# Altium project oai_kpa_mku.PrjPcb (part 2 of 2)

## Sheet Functional_Module_main.SchDoc: =GlobalProjectName
size 209 x 297 mm; ApprovedBy: Утвердил; CheckedBy: Проверил; Author: Разработал; DocumentNumber: ЮМП.250. Э3; Revision: #2.2; SheetNumber: 8; SheetTotal: 9; PageSetup: Record=PageOptions|CenterHorizontal=True|CenterVertical=True|PrintScale=1.00|XCorrection=1.00|YCorrection=1.00|PrintKind=1|BorderSize=5000000|LeftOffset=0|BottomOffset=0|Orientation=2|PaperLength=1000|PaperWidth=1000|Scale=100|PaperSource=15|PrintQuality=1200|MediaType=1|DitherType=10|PaperKind=A3|PrintScaleMode=1; Weight: -; ScaleFactor: -; NormInspection: Норм.Контр.; FirstApplication: ЮМП.250.; DocumentName: OAI_KPA_MKU
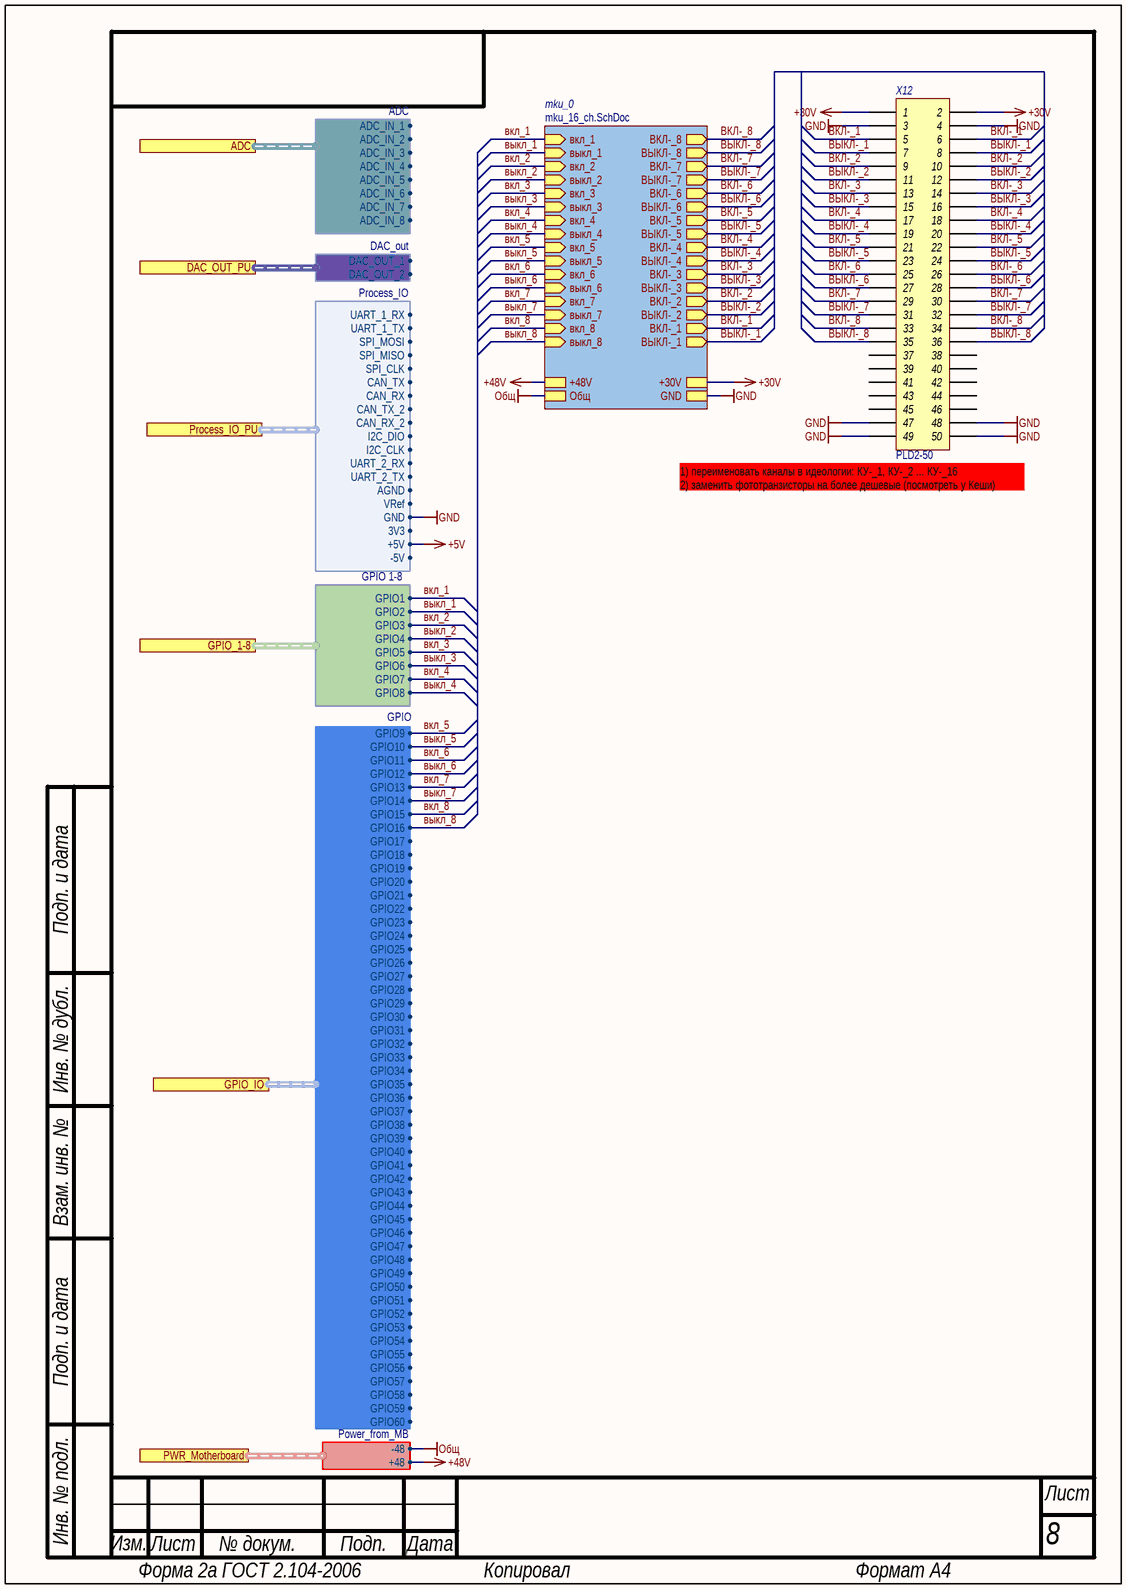
[diagram p7: Functional_Module_main.SchDoc]

### Parts
X12  Header 2X25  [PLD2-50]  (value not drawn)

### Sub-sheets
mku_0 = mku_16_ch.SchDoc: Общ, GND, вкл_2 (in), вкл_4 (in), вкл_3 (in), выкл_1 (in), выкл_5 (in), выкл_8 (in), вкл_7 (in), ВЫКЛ-_1 (out), вкл_1 (in), ВКЛ-_1 (out), выкл_7 (in), выкл_6 (in), выкл_2 (in), вкл_5 (in), вкл_6 (in), выкл_3 (in), вкл_8 (in), выкл_4 (in), ВЫКЛ-_2 (out), ВКЛ-_2 (out), ВЫКЛ-_3 (out), ВКЛ-_3 (out), ВЫКЛ-_4 (out), ВКЛ-_4 (out), ВЫКЛ-_5 (out), ВКЛ-_5 (out), ВЫКЛ-_6 (out), ВКЛ-_6 (out), ВЫКЛ-_7 (out), ВКЛ-_7 (out), ВЫКЛ-_8 (out), ВКЛ-_8 (out), +48V, +30V

### Ports
ADC (harness ADC), DAC_OUT_PU (harness DAC_out), GPIO_1-8 (harness GPIO 1-8), GPIO_IO (harness GPIO), Process_IO_PU (harness Process_IO), PWR_Motherboard (harness Power_from_MB)

### Harnesses
Process_IO: UART_1_RX, UART_1_TX, SPI_MOSI, SPI_MISO, SPI_CLK, CAN_TX, CAN_RX, I2C_DIO, I2C_CLK, UART_2_RX, UART_2_TX, AGND, VRef, GND, 3V3, +5V, -5V, CAN_TX_2, CAN_RX_2
DAC_out: DAC_OUT_1, DAC_OUT_2
GPIO 1-8: GPIO1, GPIO2, GPIO3, GPIO4, GPIO5, GPIO6, GPIO7, GPIO8
Power_from_MB: -48, +48
ADC: ADC_IN_1, ADC_IN_3, ADC_IN_7, ADC_IN_5, ADC_IN_2, ADC_IN_4, ADC_IN_6, ADC_IN_8
GPIO: GPIO9, GPIO10, GPIO11, GPIO12, GPIO13, GPIO14, GPIO15, GPIO16, GPIO17, GPIO18, GPIO19, GPIO20, GPIO21, GPIO22, GPIO23, GPIO24, GPIO25, GPIO26, GPIO27, GPIO28, GPIO29, GPIO30, GPIO31, GPIO32, GPIO33, GPIO34, GPIO35, GPIO36, GPIO37, GPIO38, GPIO39, GPIO40, GPIO41, GPIO42, GPIO43, GPIO44, GPIO45, GPIO46, GPIO47, GPIO48, GPIO49, GPIO50, GPIO51, GPIO52, GPIO53, GPIO54, GPIO55, GPIO56, GPIO57, GPIO58, GPIO59, GPIO60

### Nets
+30V: X12.1 X12.2 ; sheet mku_0/+30V
+48V: sheet mku_0/+48V, port PWR_Motherboard.+48  [project net Power_IN]
GND: X12.3 X12.4 X12.47 X12.48 X12.49 X12.50 ; sheet mku_0/GND, port Process_IO_PU.GND
Общ: sheet mku_0/Общ, port PWR_Motherboard.-48  [project net GND_IN]
ВКЛ-_1: X12.5 X12.6 ; sheet mku_0/ВКЛ-_1
ВКЛ-_2: X12.9 X12.10 ; sheet mku_0/ВКЛ-_2
ВКЛ-_3: X12.13 X12.14 ; sheet mku_0/ВКЛ-_3
ВКЛ-_4: X12.17 X12.18 ; sheet mku_0/ВКЛ-_4
ВКЛ-_5: X12.21 X12.22 ; sheet mku_0/ВКЛ-_5
ВКЛ-_6: X12.25 X12.26 ; sheet mku_0/ВКЛ-_6
ВКЛ-_7: X12.29 X12.30 ; sheet mku_0/ВКЛ-_7
ВКЛ-_8: X12.33 X12.34 ; sheet mku_0/ВКЛ-_8
вкл_1: sheet mku_0/вкл_1, port GPIO_1-8.GPIO1  [project net GPIO_1]
вкл_2: sheet mku_0/вкл_2, port GPIO_1-8.GPIO3  [project net GPIO_3]
вкл_3: sheet mku_0/вкл_3, port GPIO_1-8.GPIO5  [project net GPIO_5]
вкл_4: sheet mku_0/вкл_4, port GPIO_1-8.GPIO7  [project net GPIO_7]
вкл_5: sheet mku_0/вкл_5, port GPIO_IO.GPIO9  [project net GPIO_9]
вкл_6: sheet mku_0/вкл_6, port GPIO_IO.GPIO11  [project net GPIO_11]
вкл_7: sheet mku_0/вкл_7, port GPIO_IO.GPIO13  [project net GPIO_13]
вкл_8: sheet mku_0/вкл_8, port GPIO_IO.GPIO15  [project net GPIO_15]
ВЫКЛ-_1: X12.7 X12.8 ; sheet mku_0/ВЫКЛ-_1
ВЫКЛ-_2: X12.11 X12.12 ; sheet mku_0/ВЫКЛ-_2
ВЫКЛ-_3: X12.15 X12.16 ; sheet mku_0/ВЫКЛ-_3
ВЫКЛ-_4: X12.19 X12.20 ; sheet mku_0/ВЫКЛ-_4
ВЫКЛ-_5: X12.23 X12.24 ; sheet mku_0/ВЫКЛ-_5
ВЫКЛ-_6: X12.27 X12.28 ; sheet mku_0/ВЫКЛ-_6
ВЫКЛ-_7: X12.31 X12.32 ; sheet mku_0/ВЫКЛ-_7
ВЫКЛ-_8: X12.35 X12.36 ; sheet mku_0/ВЫКЛ-_8
выкл_1: sheet mku_0/выкл_1, port GPIO_1-8.GPIO2  [project net GPIO_2]
выкл_2: sheet mku_0/выкл_2, port GPIO_1-8.GPIO4  [project net GPIO_4]
выкл_3: sheet mku_0/выкл_3, port GPIO_1-8.GPIO6  [project net GPIO_6]
выкл_4: sheet mku_0/выкл_4, port GPIO_1-8.GPIO8  [project net GPIO_8]
выкл_5: sheet mku_0/выкл_5, port GPIO_IO.GPIO10  [project net GPIO_10]
выкл_6: sheet mku_0/выкл_6, port GPIO_IO.GPIO12  [project net GPIO_12]
выкл_7: sheet mku_0/выкл_7, port GPIO_IO.GPIO14  [project net GPIO_14]
выкл_8: sheet mku_0/выкл_8, port GPIO_IO.GPIO16  [project net GPIO_16]

Not connected (* = marked no-connect by the designer): X12 37 38 39 40 41 42 43 44 45 46

### Notes on the sheet
- (near X12) 1) переименовать каналы в идеологии: КУ-_1, КУ-_2 ... КУ-_16
  2) заменить фототранзисторы на более дешевые (посмотреть у Кеши)
- Подп. и дата
- Инв. № дубл.
- Взам. инв. №
- Инв. № подл.
- Изм.
- Лист
- № докум.
- Подп.
- Дата
- Форма 2а ГОСТ 2.104-2006
- Копировал
- Формат А4

### Library data of the parts
X12 = PLD2-50: Header, 50-Pin, Dual row; Назначение: Header, 20-Pin, Dual row; Потребление, Вт: 0,0; Наименование: PLD2-50

## Sheet mku_16_ch.SchDoc: =GlobalProjectName
size 209 x 297 mm; ApprovedBy: Утвердил; CheckedBy: Проверил; Author: Разработал; DocumentNumber: ЮМП.250. Э3; Revision: #2.2; SheetNumber: 9; SheetTotal: 10; PageSetup: Record=PageOptions|CenterHorizontal=True|CenterVertical=True|PrintScale=1.00|XCorrection=1.00|YCorrection=1.00|PrintKind=1|BorderSize=5000000|LeftOffset=0|BottomOffset=0|Orientation=2|PaperLength=1000|PaperWidth=1000|Scale=100|PaperSource=15|PrintQuality=1200|MediaType=1|DitherType=10|PaperKind=A3|PrintScaleMode=1; Weight: -; ScaleFactor: -; NormInspection: Норм.Контр.; FirstApplication: ЮМП.250.; DocumentName: OAI_KPA_MKU
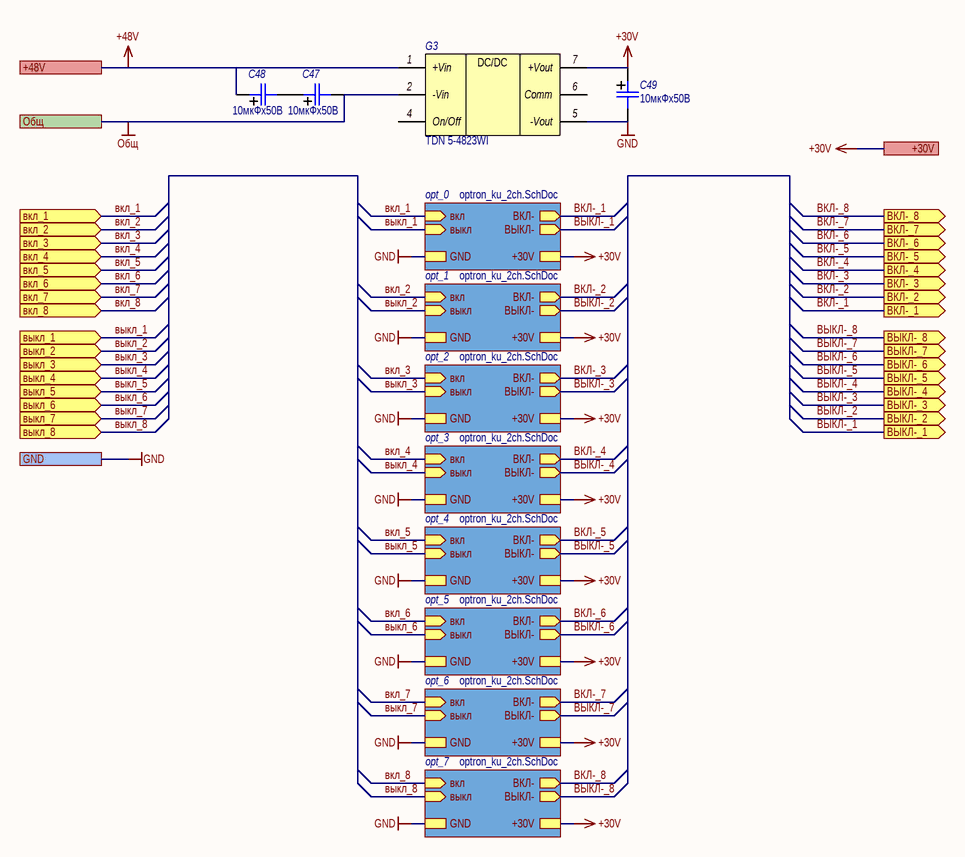
[diagram p8: mku_16_ch.SchDoc]

### Parts
C47  10мкФх50В  [SMD_size_C]
C48  10мкФх50В  [SMD_size_C]
C49  10мкФх50В  [SMD_size_C]
G3  Наименование: TDN 5-4823WI  [TDN_5_WISM]  (hidden comment: TDN 5-4821)

### Sub-sheets
opt_0 = optron_ku_2ch.SchDoc: GND, ВКЛ- (out), ВЫКЛ- (out), вкл (in), выкл (in), +30V
opt_1 = optron_ku_2ch.SchDoc: GND, ВКЛ- (out), ВЫКЛ- (out), вкл (in), выкл (in), +30V
opt_2 = optron_ku_2ch.SchDoc: GND, ВКЛ- (out), ВЫКЛ- (out), вкл (in), выкл (in), +30V
opt_3 = optron_ku_2ch.SchDoc: GND, ВКЛ- (out), ВЫКЛ- (out), вкл (in), выкл (in), +30V
opt_4 = optron_ku_2ch.SchDoc: GND, ВКЛ- (out), ВЫКЛ- (out), вкл (in), выкл (in), +30V
opt_5 = optron_ku_2ch.SchDoc: GND, ВКЛ- (out), ВЫКЛ- (out), вкл (in), выкл (in), +30V
opt_6 = optron_ku_2ch.SchDoc: GND, ВКЛ- (out), ВЫКЛ- (out), вкл (in), выкл (in), +30V
opt_7 = optron_ku_2ch.SchDoc: GND, ВКЛ- (out), ВЫКЛ- (out), вкл (in), выкл (in), +30V

### Ports
+30V, +48V, GND, ВКЛ-_1 (out), ВКЛ-_2 (out), ВКЛ-_3 (out), ВКЛ-_4 (out), ВКЛ-_5 (out), ВКЛ-_6 (out), ВКЛ-_7 (out), ВКЛ-_8 (out), вкл_1 (in), вкл_2 (in), вкл_3 (in), вкл_4 (in), вкл_5 (in), вкл_6 (in), вкл_7 (in), вкл_8 (in), ВЫКЛ-_1 (out), ВЫКЛ-_2 (out), ВЫКЛ-_3 (out), ВЫКЛ-_4 (out), ВЫКЛ-_5 (out), ВЫКЛ-_6 (out), ВЫКЛ-_7 (out), ВЫКЛ-_8 (out), выкл_1 (in), выкл_2 (in), выкл_3 (in), выкл_4 (in), выкл_5 (in), выкл_6 (in), выкл_7 (in), выкл_8 (in), Общ

### Nets
+30V: C49.1 G3.7(+Vout) ; port +30V, sheet opt_0/+30V, sheet opt_1/+30V, sheet opt_2/+30V, sheet opt_3/+30V, sheet opt_4/+30V, sheet opt_5/+30V, sheet opt_6/+30V, sheet opt_7/+30V
+48V: C48.1 G3.1(+Vin) ; port +48V  [project net Power_IN]
GND: C49.2 G3.5(-Vout) ; port GND, sheet opt_0/GND, sheet opt_1/GND, sheet opt_2/GND, sheet opt_3/GND, sheet opt_4/GND, sheet opt_5/GND, sheet opt_6/GND, sheet opt_7/GND
Общ: C47.2 G3.2(-Vin) ; port Общ  [project net GND_IN]
ВКЛ-_1: port ВКЛ-_1, sheet opt_0/ВКЛ-
ВКЛ-_2: port ВКЛ-_2, sheet opt_1/ВКЛ-
ВКЛ-_3: port ВКЛ-_3, sheet opt_2/ВКЛ-
ВКЛ-_4: port ВКЛ-_4, sheet opt_3/ВКЛ-
ВКЛ-_5: port ВКЛ-_5, sheet opt_4/ВКЛ-
ВКЛ-_6: port ВКЛ-_6, sheet opt_5/ВКЛ-
ВКЛ-_7: port ВКЛ-_7, sheet opt_6/ВКЛ-
ВКЛ-_8: port ВКЛ-_8, sheet opt_7/ВКЛ-
вкл_1: port вкл_1, sheet opt_0/вкл  [project net GPIO_1]
вкл_2: port вкл_2, sheet opt_1/вкл  [project net GPIO_3]
вкл_3: port вкл_3, sheet opt_2/вкл  [project net GPIO_5]
вкл_4: port вкл_4, sheet opt_3/вкл  [project net GPIO_7]
вкл_5: port вкл_5, sheet opt_4/вкл  [project net GPIO_9]
вкл_6: port вкл_6, sheet opt_5/вкл  [project net GPIO_11]
вкл_7: port вкл_7, sheet opt_6/вкл  [project net GPIO_13]
вкл_8: port вкл_8, sheet opt_7/вкл  [project net GPIO_15]
ВЫКЛ-_1: port ВЫКЛ-_1, sheet opt_0/ВЫКЛ-
ВЫКЛ-_2: port ВЫКЛ-_2, sheet opt_1/ВЫКЛ-
ВЫКЛ-_3: port ВЫКЛ-_3, sheet opt_2/ВЫКЛ-
ВЫКЛ-_4: port ВЫКЛ-_4, sheet opt_3/ВЫКЛ-
ВЫКЛ-_5: port ВЫКЛ-_5, sheet opt_4/ВЫКЛ-
ВЫКЛ-_6: port ВЫКЛ-_6, sheet opt_5/ВЫКЛ-
ВЫКЛ-_7: port ВЫКЛ-_7, sheet opt_6/ВЫКЛ-
ВЫКЛ-_8: port ВЫКЛ-_8, sheet opt_7/ВЫКЛ-
выкл_1: port выкл_1, sheet opt_0/выкл  [project net GPIO_2]
выкл_2: port выкл_2, sheet opt_1/выкл  [project net GPIO_4]
выкл_3: port выкл_3, sheet opt_2/выкл  [project net GPIO_6]
выкл_4: port выкл_4, sheet opt_3/выкл  [project net GPIO_8]
выкл_5: port выкл_5, sheet opt_4/выкл  [project net GPIO_10]
выкл_6: port выкл_6, sheet opt_5/выкл  [project net GPIO_12]
выкл_7: port выкл_7, sheet opt_6/выкл  [project net GPIO_14]
выкл_8: port выкл_8, sheet opt_7/выкл  [project net GPIO_16]
NetC47_1: C47.1 C48.2

Not connected (* = marked no-connect by the designer): G3 4(On/Off) 6(Comm)

### Notes on the sheet
- Подп. и дата
- Инв. № дубл.
- Взам. инв. №
- Инв. № подл.
- Изм.
- Лист
- № докум.
- Подп.
- Дата
- Форма 2а ГОСТ 2.104-2006
- Копировал
- Формат А4
- (in symbol TDN_5) DC/DC

### Library data of the parts
C47-C49 = Capacitor_pol: Polarized capacitor; Назначение: Поляризованный SMD-конденсатор; Наименование: Поляризованный конденсатор; Потребление, Вт: 0; Value: 10мкФх50В
G3 = TDN_5: DC/DC converter; Назначение: DC-DC преобразователь; Потребление, Вт: 0,01; DataSheet: https://www.tracopower.com/sites/default/files/products/datasheets/tdn5wi_datasheet.pdf

## Sheet optron_ku_2ch.SchDoc: =GlobalProjectName
size 209 x 297 mm; ApprovedBy: Прокопьев; CheckedBy: Прокопьев; Author: Стюф; DocumentNumber: ЮМП.250. Э3; Revision: #2.2; SheetNumber: 10; SheetTotal: 10; PageSetup: Record=PageOptions|CenterHorizontal=True|CenterVertical=True|PrintScale=1.00|XCorrection=1.00|YCorrection=1.00|PrintKind=1|BorderSize=5000000|LeftOffset=0|BottomOffset=0|Orientation=2|PaperLength=1000|PaperWidth=1000|Scale=100|PaperSource=15|PrintQuality=1200|MediaType=1|DitherType=10|PaperKind=A3|PrintScaleMode=1; Weight: -; ScaleFactor: -; NormInspection: Задорожная; FirstApplication: ЮМП.250.; DocumentName: OAI_KPA_MKU
Used 8 times, as channels Device_unit/mku_0/opt_0, Device_unit/mku_0/opt_1, Device_unit/mku_0/opt_2, Device_unit/mku_0/opt_3, Device_unit/mku_0/opt_4, Device_unit/mku_0/opt_5, Device_unit/mku_0/opt_6, Device_unit/mku_0/opt_7. Parts and nets are listed once, with the designators drawn on the sheet.
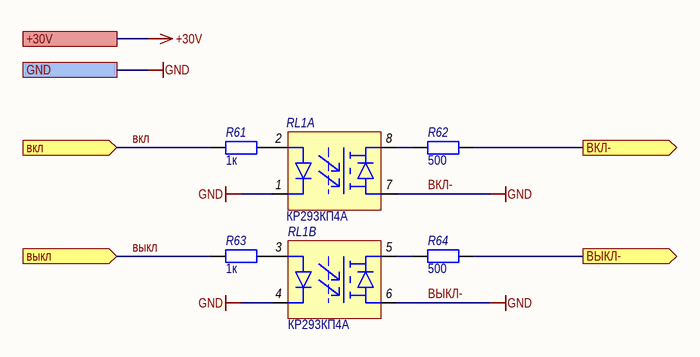
[diagram p9: optron_ku_2ch.SchDoc]

### Parts
R61  1к  [SMD_0805]
R62  500  [SMD_0805]
R63  1к  [SMD_0805]
R64  500  [SMD_0805]
RL1  KR293KP4A  [DIP-8]  (value not drawn)  (parts A,B of 2)

### Ports
+30V, GND, вкл (in), ВКЛ- (out), выкл (in), ВЫКЛ- (out)

### Nets
ВКЛ-: RL1.1 RL1.4 RL1.6 RL1.7 ; port GND  [also labelled GND, ВЫКЛ-]
вкл: R61.1 ; port вкл
ВКЛ-: R62.2 ; port ВКЛ-  [a separate net that carries the same name]
выкл: R63.1 ; port выкл
ВЫКЛ-: R64.2 ; port ВЫКЛ-
NetR61_2: R61.2 RL1.2
NetR62_1: R62.1 RL1.8
NetR63_2: R63.2 RL1.3
NetR64_1: R64.1 RL1.5

### Channels
Device_unit/mku_0/opt_0: designators end in _opt_0; ports +30V=+30V GND=GND ВКЛ-=ВКЛ-_1 вкл=GPIO_1 ВЫКЛ-=ВЫКЛ-_1 выкл=GPIO_2
Device_unit/mku_0/opt_1: designators end in _opt_1; ports +30V=+30V GND=GND ВКЛ-=ВКЛ-_2 вкл=GPIO_3 ВЫКЛ-=ВЫКЛ-_2 выкл=GPIO_4
Device_unit/mku_0/opt_2: designators end in _opt_2; ports +30V=+30V GND=GND ВКЛ-=ВКЛ-_3 вкл=GPIO_5 ВЫКЛ-=ВЫКЛ-_3 выкл=GPIO_6
Device_unit/mku_0/opt_3: designators end in _opt_3; ports +30V=+30V GND=GND ВКЛ-=ВКЛ-_4 вкл=GPIO_7 ВЫКЛ-=ВЫКЛ-_4 выкл=GPIO_8
Device_unit/mku_0/opt_4: designators end in _opt_4; ports +30V=+30V GND=GND ВКЛ-=ВКЛ-_5 вкл=GPIO_9 ВЫКЛ-=ВЫКЛ-_5 выкл=GPIO_10
Device_unit/mku_0/opt_5: designators end in _opt_5; ports +30V=+30V GND=GND ВКЛ-=ВКЛ-_6 вкл=GPIO_11 ВЫКЛ-=ВЫКЛ-_6 выкл=GPIO_12
Device_unit/mku_0/opt_6: designators end in _opt_6; ports +30V=+30V GND=GND ВКЛ-=ВКЛ-_7 вкл=GPIO_13 ВЫКЛ-=ВЫКЛ-_7 выкл=GPIO_14
Device_unit/mku_0/opt_7: designators end in _opt_7; ports +30V=+30V GND=GND ВКЛ-=ВКЛ-_8 вкл=GPIO_15 ВЫКЛ-=ВЫКЛ-_8 выкл=GPIO_16

### Notes on the sheet
- Подп. и дата
- Инв. № дубл.
- Взам. инв. №
- Инв. № подл.
- Изм.
- Лист
- № докум.
- Подп.
- Дата
- Форма 2а ГОСТ 2.104-2006
- Копировал
- Формат А4

### Library data of the parts
R61-R64 = Resistor: Наименование: Резистор; Назначение: SMD-резистор; Потребление, Вт: 0,001
  R61 R63: Value: 1к
  R62 R64: Value: 500
RL1 = КР293КП4А: Сдвоенное однонаправленное МОП-реле с низким сопротивлением / 60В/2.5Ом; Потребление, Вт: 0,001; Назначение: Сдвоенное однонаправленное МОП-реле с низким сопротивлением; ComponentLink1Description: DataSheet; ComponentLink1URL: https://static.chipdip.ru/lib/242/DOC000242149.pdf; Наименование: КР293КП4А

## Nets that join several sheets
2V048: Module_main (X7.9), main (U1.32), power (C27.2 U3.3 U3.4)
3.3V: Module_main (X8.4 X9.3 X9.4), main (40 pins), power (12 pins)
3V3A: main (U1.33), power (C28.2 L2.2 U3.1 U3.2)
+5V: Module_main (X9.7 X9.8), power (R30.2 U2.8 U2.9)
+30V: Functional_Module_main (X12.1 X12.2), mku_16_ch (C49.1 G3.7)
-5V: Module_main (X9.9 X9.10), power (C21.1 C22.2 G1.5)
A_GND: Module_main (X7.10 X8.19 X8.20), main (U1.31), adc (8 pins), dac (C45.1 C46.1), power (C27.1 C28.1 L3.2 U3.5)
GND: Module_main (10 pins), main (36 pins), USB (C40.2 C41.1 U5.9 U5.15), power (21 pins), Functional_Module_main (6 pins), mku_16_ch (C49.2 G3.5), Device_unit/mku_0/opt_0 (RL1_opt_0.1 RL1_opt_0.4 RL1_opt_0.6 RL1_opt_0.7), Device_unit/mku_0/opt_1 (RL1_opt_1.1 RL1_opt_1.4 RL1_opt_1.6 RL1_opt_1.7), Device_unit/mku_0/opt_2 (RL1_opt_2.1 RL1_opt_2.4 RL1_opt_2.6 RL1_opt_2.7), Device_unit/mku_0/opt_3 (RL1_opt_3.1 RL1_opt_3.4 RL1_opt_3.6 RL1_opt_3.7), Device_unit/mku_0/opt_4 (RL1_opt_4.1 RL1_opt_4.4 RL1_opt_4.6 RL1_opt_4.7), Device_unit/mku_0/opt_5 (RL1_opt_5.1 RL1_opt_5.4 RL1_opt_5.6 RL1_opt_5.7), Device_unit/mku_0/opt_6 (RL1_opt_6.1 RL1_opt_6.4 RL1_opt_6.6 RL1_opt_6.7), Device_unit/mku_0/opt_7 (RL1_opt_7.1 RL1_opt_7.4 RL1_opt_7.6 RL1_opt_7.7)
GND_IN: Module_main (8 pins), main (L1.1 X3.11 X3.12), power (C17.2 C18.1 G1.2), mku_16_ch (C47.2 G3.2)
Power_IN: Module_main (X10.1 X10.2 X10.3 X10.4), main (X3.9 X3.10), power (C16.1 C18.2 G1.1), mku_16_ch (C48.1 G3.1)
USB_GND_IN: main (L1.2 X3.7 X3.8), USB (7 pins)
ADC_IN_1: Module_main (X7.1), adc (R37.2)
ADC_IN_2: Module_main (X7.2), adc (R38.2)
ADC_IN_3: Module_main (X7.3), adc (R39.2)
ADC_IN_4: Module_main (X7.4), adc (R40.2)
ADC_IN_5: Module_main (X7.5), adc (R41.2)
ADC_IN_6: Module_main (X7.6), adc (R42.2)
ADC_IN_7: Module_main (X7.7), adc (R43.2)
ADC_IN_8: Module_main (X7.8), adc (R44.2)
ADC_MC_IN_1: main (U1.34), adc (C32.2 R37.1)
ADC_MC_IN_2: main (U1.35), adc (C33.2 R38.1)
ADC_MC_IN_3: main (U1.36), adc (C34.2 R39.1)
ADC_MC_IN_4: main (U1.37), adc (C35.2 R40.1)
ADC_MC_IN_5: main (U1.18), adc (C36.2 R41.1)
ADC_MC_IN_6: main (U1.19), adc (C37.2 R42.1)
ADC_MC_IN_7: main (U1.20), adc (C38.2 R43.1)
ADC_MC_IN_8: main (U1.21), adc (C39.2 R44.1)
CAN_RX: Module_main (X8.11), main (R13.2)
CAN_TX: Module_main (X8.12), main (R14.2)
D_IN_3_N: main (U1.103), USB (L6.2)
D_IN_3_P: main (U1.104), USB (L6.3)
DAC_MC_Out_1: main (U1.40), dac (R49.1)
DAC_MC_Out_2: main (U1.41), dac (R50.1)
DAC_OUT_1: Module_main (X8.17), dac (C45.2 R49.2)
DAC_OUT_2: Module_main (X8.18), dac (C46.2 R50.2)
GPIO_1: Module_main (X9.11), GPIO_Shunt (R51.2), Device_unit/mku_0/opt_0 (R61_opt_0.1)
GPIO_2: Module_main (X9.12), GPIO_Shunt (R52.2), Device_unit/mku_0/opt_0 (R63_opt_0.1)
GPIO_3: Module_main (X9.13), GPIO_Shunt (R53.2), Device_unit/mku_0/opt_1 (R61_opt_1.1)
GPIO_4: Module_main (X9.14), GPIO_Shunt (R54.2), Device_unit/mku_0/opt_1 (R63_opt_1.1)
GPIO_5: Module_main (X9.15), GPIO_Shunt (R55.2), Device_unit/mku_0/opt_2 (R61_opt_2.1)
GPIO_6: Module_main (X9.16), GPIO_Shunt (R56.2), Device_unit/mku_0/opt_2 (R63_opt_2.1)
GPIO_7: Module_main (X9.17), GPIO_Shunt (R57.2), Device_unit/mku_0/opt_3 (R61_opt_3.1)
GPIO_8: Module_main (X9.18), GPIO_Shunt (R58.2), Device_unit/mku_0/opt_3 (R63_opt_3.1)
GPIO_9: main (U1.141), Device_unit/mku_0/opt_4 (R61_opt_4.1)
GPIO_10: main (U1.142), Device_unit/mku_0/opt_4 (R63_opt_4.1)
GPIO_11: main (U1.1), Device_unit/mku_0/opt_5 (R61_opt_5.1)
GPIO_12: main (U1.2), Device_unit/mku_0/opt_5 (R63_opt_5.1)
GPIO_13: main (U1.3), Device_unit/mku_0/opt_6 (R61_opt_6.1)
GPIO_14: main (U1.4), Device_unit/mku_0/opt_6 (R63_opt_6.1)
GPIO_15: main (U1.5), Device_unit/mku_0/opt_7 (R61_opt_7.1)
GPIO_16: main (U1.58), Device_unit/mku_0/opt_7 (R63_opt_7.1)
GPIO_CPU_1: main (U1.26), GPIO_Shunt (R51.1)
GPIO_CPU_2: main (U1.27), GPIO_Shunt (R52.1)
GPIO_CPU_3: main (U1.28), GPIO_Shunt (R53.1)
GPIO_CPU_4: main (U1.29), GPIO_Shunt (R54.1)
GPIO_CPU_5: main (U1.44), GPIO_Shunt (R55.1)
GPIO_CPU_6: main (U1.45), GPIO_Shunt (R56.1)
GPIO_CPU_7: main (U1.96), GPIO_Shunt (R57.1)
GPIO_CPU_8: main (U1.97), GPIO_Shunt (R58.1)
I2C_CLK: Module_main (X8.14), main (U1.11)
I2C_DIO: Module_main (X8.13), main (U1.10)
I2C_SCL: main (R20.1 U1.136), power (U2.5 U4.5)
I2C_SDA: main (R19.1 U1.137), power (U2.4 U4.4)
Out_D_1_MB_N: main (X3.3 X3.4), USB (R45.1 X5.2)
Out_D_1_MB_P: main (X3.1 X3.2), USB (R46.1 X6.2)
PWR_ALERT: main (U1.7), power (R35.2 U2.3 U4.3)
SPI_CLK: Module_main (X8.8), main (R9.2)
SPI_MISO: Module_main (X8.9), main (R10.2)
SPI_MOSI: Module_main (X8.7), main (R11.2)
UART_1_RX: Module_main (X8.3), main (R8.1)
UART_1_TX: Module_main (X8.5), main (R6.1)
UART_2_RX: Module_main (X8.15), main (R17.2)
UART_2_TX: Module_main (X8.16), main (R16.2)
V_in: main (X3.5 X3.6), USB (C42.2 C44.1 U5.1 X4.1)
ВКЛ-_1: Functional_Module_main (X12.5 X12.6), Device_unit/mku_0/opt_0 (R62_opt_0.2)
ВКЛ-_2: Functional_Module_main (X12.9 X12.10), Device_unit/mku_0/opt_1 (R62_opt_1.2)
ВКЛ-_3: Functional_Module_main (X12.13 X12.14), Device_unit/mku_0/opt_2 (R62_opt_2.2)
ВКЛ-_4: Functional_Module_main (X12.17 X12.18), Device_unit/mku_0/opt_3 (R62_opt_3.2)
ВКЛ-_5: Functional_Module_main (X12.21 X12.22), Device_unit/mku_0/opt_4 (R62_opt_4.2)
ВКЛ-_6: Functional_Module_main (X12.25 X12.26), Device_unit/mku_0/opt_5 (R62_opt_5.2)
ВКЛ-_7: Functional_Module_main (X12.29 X12.30), Device_unit/mku_0/opt_6 (R62_opt_6.2)
ВКЛ-_8: Functional_Module_main (X12.33 X12.34), Device_unit/mku_0/opt_7 (R62_opt_7.2)
ВЫКЛ-_1: Functional_Module_main (X12.7 X12.8), Device_unit/mku_0/opt_0 (R64_opt_0.2)
ВЫКЛ-_2: Functional_Module_main (X12.11 X12.12), Device_unit/mku_0/opt_1 (R64_opt_1.2)
ВЫКЛ-_3: Functional_Module_main (X12.15 X12.16), Device_unit/mku_0/opt_2 (R64_opt_2.2)
ВЫКЛ-_4: Functional_Module_main (X12.19 X12.20), Device_unit/mku_0/opt_3 (R64_opt_3.2)
ВЫКЛ-_5: Functional_Module_main (X12.23 X12.24), Device_unit/mku_0/opt_4 (R64_opt_4.2)
ВЫКЛ-_6: Functional_Module_main (X12.27 X12.28), Device_unit/mku_0/opt_5 (R64_opt_5.2)
ВЫКЛ-_7: Functional_Module_main (X12.31 X12.32), Device_unit/mku_0/opt_6 (R64_opt_6.2)
ВЫКЛ-_8: Functional_Module_main (X12.35 X12.36), Device_unit/mku_0/opt_7 (R64_opt_7.2)